# Altium schematic sheet Connectors.SchDoc: Connectors
size Letter; Date: 2017-02-19; Revision: A; SheetNumber: 5; SheetTotal: 6; ProjectTitle: CANwheel
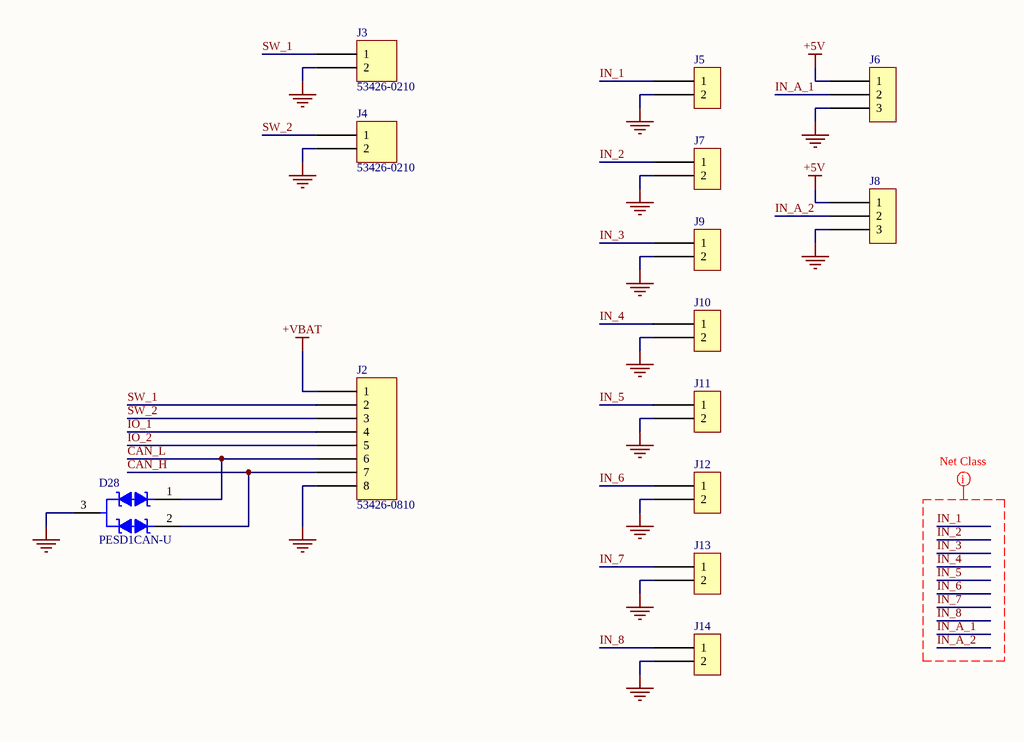
[diagram p0: Connectors.SchDoc]

## Parts
D28  PESD1CAN-U  [SOT65P210X110-3N]
J2  53426-0810  [53426-0810]
J3  53426-0210  [53426-0210]
J4  53426-0210  [53426-0210]
J5  Wire-2-0.7mm  [WIRE-2-0.7mm]  (value not drawn)
J6  Wire-3-0.7mm  [WIRE-3-0.7mm]  (value not drawn)
J7  Wire-2-0.7mm  [WIRE-2-0.7mm]  (value not drawn)
J8  Wire-3-0.7mm  [WIRE-3-0.7mm]  (value not drawn)
J9  Wire-2-0.7mm  [WIRE-2-0.7mm]  (value not drawn)
J10  Wire-2-0.7mm  [WIRE-2-0.7mm]  (value not drawn)
J11  Wire-2-0.7mm  [WIRE-2-0.7mm]  (value not drawn)
J12  Wire-2-0.7mm  [WIRE-2-0.7mm]  (value not drawn)
J13  Wire-2-0.7mm  [WIRE-2-0.7mm]  (value not drawn)
J14  Wire-2-0.7mm  [WIRE-2-0.7mm]  (value not drawn)

## Nets
+5V: J6.1 J8.1
+VBAT: J2.1
GND: D28.3 J2.8 J3.2 J4.2 J5.2 J6.3 J7.2 J8.3 J9.2 J10.2 J11.2 J12.2 J13.2 J14.2
CAN_H: D28.2 J2.7
CAN_L: D28.1 J2.6
IN_1: J5.1
IN_2: J7.1
IN_3: J9.1
IN_4: J10.1
IN_5: J11.1
IN_6: J12.1
IN_7: J13.1
IN_8: J14.1
IN_A_1: J6.2
IN_A_2: J8.2
IO_1: J2.4
IO_2: J2.5
SW_1: J2.2 J3.1
SW_2: J2.3 J4.1

## Layout directives
net class INPUT: IN_1, IN_2, IN_3, IN_4, IN_5, IN_6, IN_7, IN_8, IN_A_1, IN_A_2

## Notes on the sheet
- Date:
- Revision:
- Sheet:
- /

## Library data of the parts
J2 = 53426-0810: Molex Mini-Lock™ 53426
J3 J4 = 53426-0210: Molex Mini-Lock™ 53426